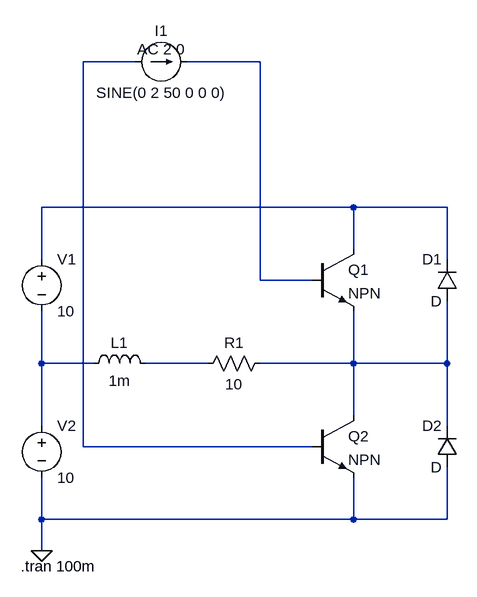
[diagram p0: schematic half.asc]
half.asc, the LTspice schematic file:
Version 4.1
SHEET 1 880 680
WIRE 112 -256 32 -256
WIRE 304 -256 192 -256
WIRE 448 -32 -32 -32
WIRE 592 -32 448 -32
WIRE 448 32 448 -32
WIRE -32 48 -32 -32
WIRE 592 48 592 -32
WIRE 304 80 304 -256
WIRE 384 80 304 80
WIRE -32 208 -32 128
WIRE 48 208 -32 208
WIRE 224 208 128 208
WIRE 448 208 448 128
WIRE 448 208 304 208
WIRE 592 208 592 112
WIRE 592 208 448 208
WIRE 448 288 448 208
WIRE -32 304 -32 208
WIRE 592 304 592 208
WIRE 32 336 32 -256
WIRE 384 336 32 336
WIRE -32 448 -32 384
WIRE 448 448 448 384
WIRE 448 448 -32 448
WIRE 592 448 592 368
WIRE 592 448 448 448
WIRE -32 496 -32 448
FLAG -32 496 0
SYMBOL voltage -32 32 R0
WINDOW 123 0 0 Left 0
WINDOW 39 0 0 Left 0
SYMATTR InstName V1
SYMATTR Value 10
SYMBOL voltage -32 288 R0
WINDOW 123 0 0 Left 0
WINDOW 39 0 0 Left 0
SYMATTR InstName V2
SYMATTR Value 10
SYMBOL res 320 192 R90
WINDOW 0 0 56 VBottom 2
WINDOW 3 32 56 VTop 2
SYMATTR InstName R1
SYMATTR Value 10
SYMBOL ind 32 224 R270
WINDOW 0 32 56 VTop 2
WINDOW 3 5 56 VBottom 2
SYMATTR InstName L1
SYMATTR Value 1m
SYMBOL diode 608 112 R180
WINDOW 0 24 64 Left 2
WINDOW 3 24 0 Left 2
SYMATTR InstName D1
SYMBOL diode 608 368 R180
WINDOW 0 24 64 Left 2
WINDOW 3 24 0 Left 2
SYMATTR InstName D2
SYMBOL npn 384 32 R0
SYMATTR InstName Q1
SYMBOL npn 384 288 R0
SYMATTR InstName Q2
SYMBOL current 112 -256 R270
WINDOW 0 32 40 VTop 2
WINDOW 3 -32 40 VBottom 2
WINDOW 123 4 40 VTop 2
WINDOW 39 0 0 Left 0
SYMATTR InstName I1
SYMATTR Value SINE(0 2 50 0 0 0)
SYMATTR Value2 AC 2 0
TEXT -64 520 Left 2 !.tran 100m

The netlist it stands for:
* half.asc
V1 N003 N004 10
V2 N004 0 10
R1 N006 N005 10
L1 N004 N005 1m
D1 N006 N003 D
D2 0 N006 D
Q1 N003 N002 N006 0 NPN
Q2 N006 N001 0 0 NPN
I1 N001 N002 SINE(0 2 50 0 0 0) AC 2 0
.model D D
.lib standard.dio
.model NPN NPN
.model PNP PNP
.lib standard.bjt
.tran 100m
.backanno
.end